# EAGLE design LEDboard_v0.2-R001 (EAGLE 6.5.0)
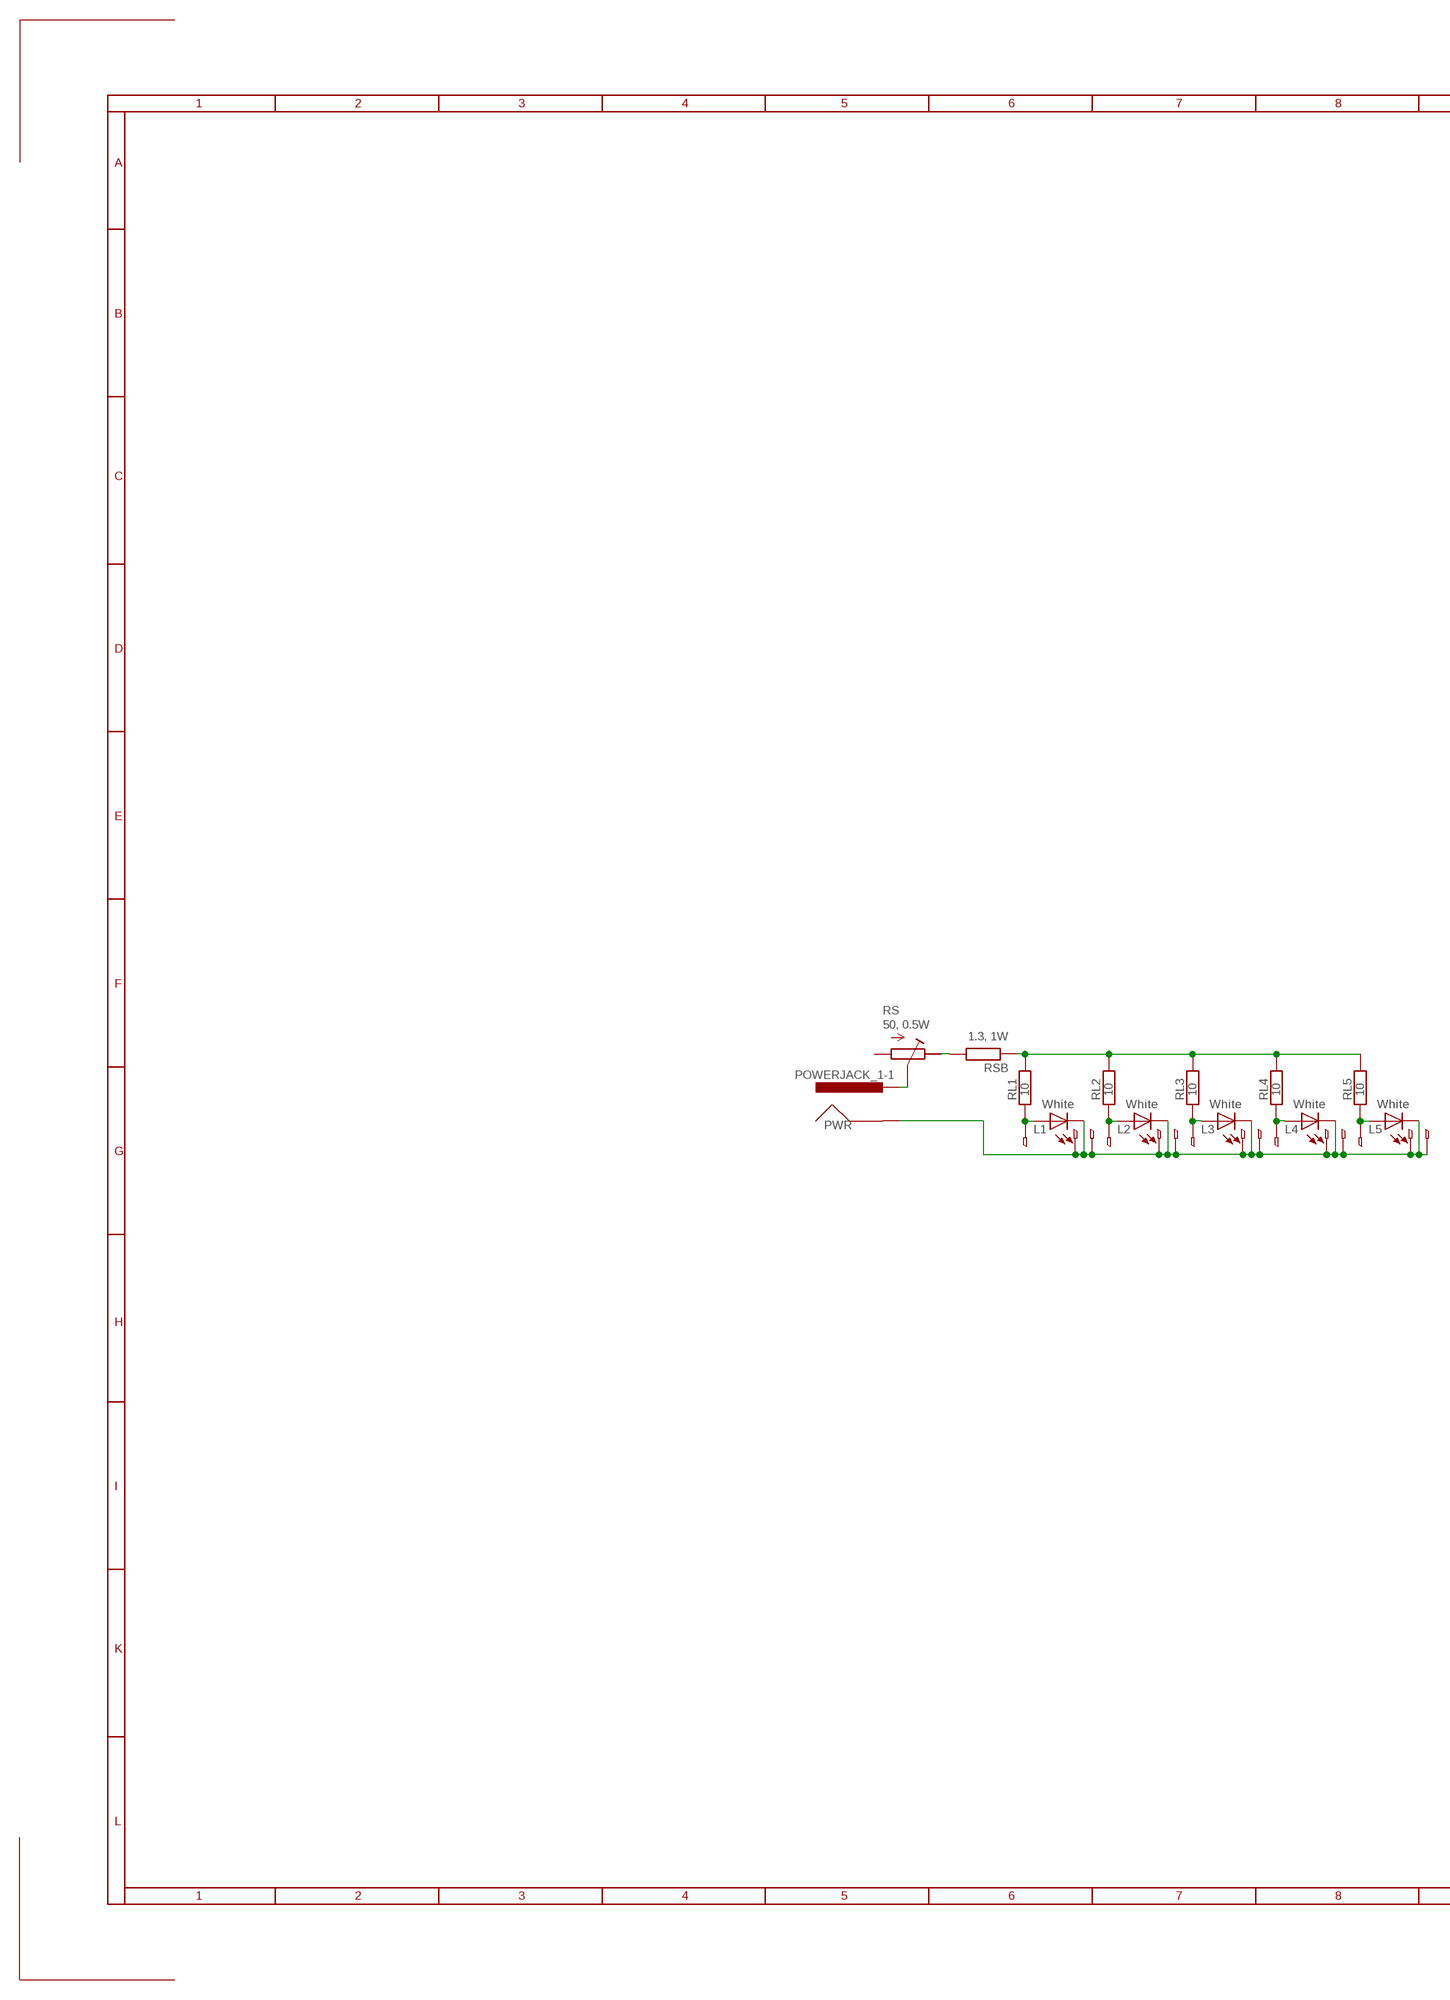
[diagram p0: schematic, sheet 1, part 1 of 2]
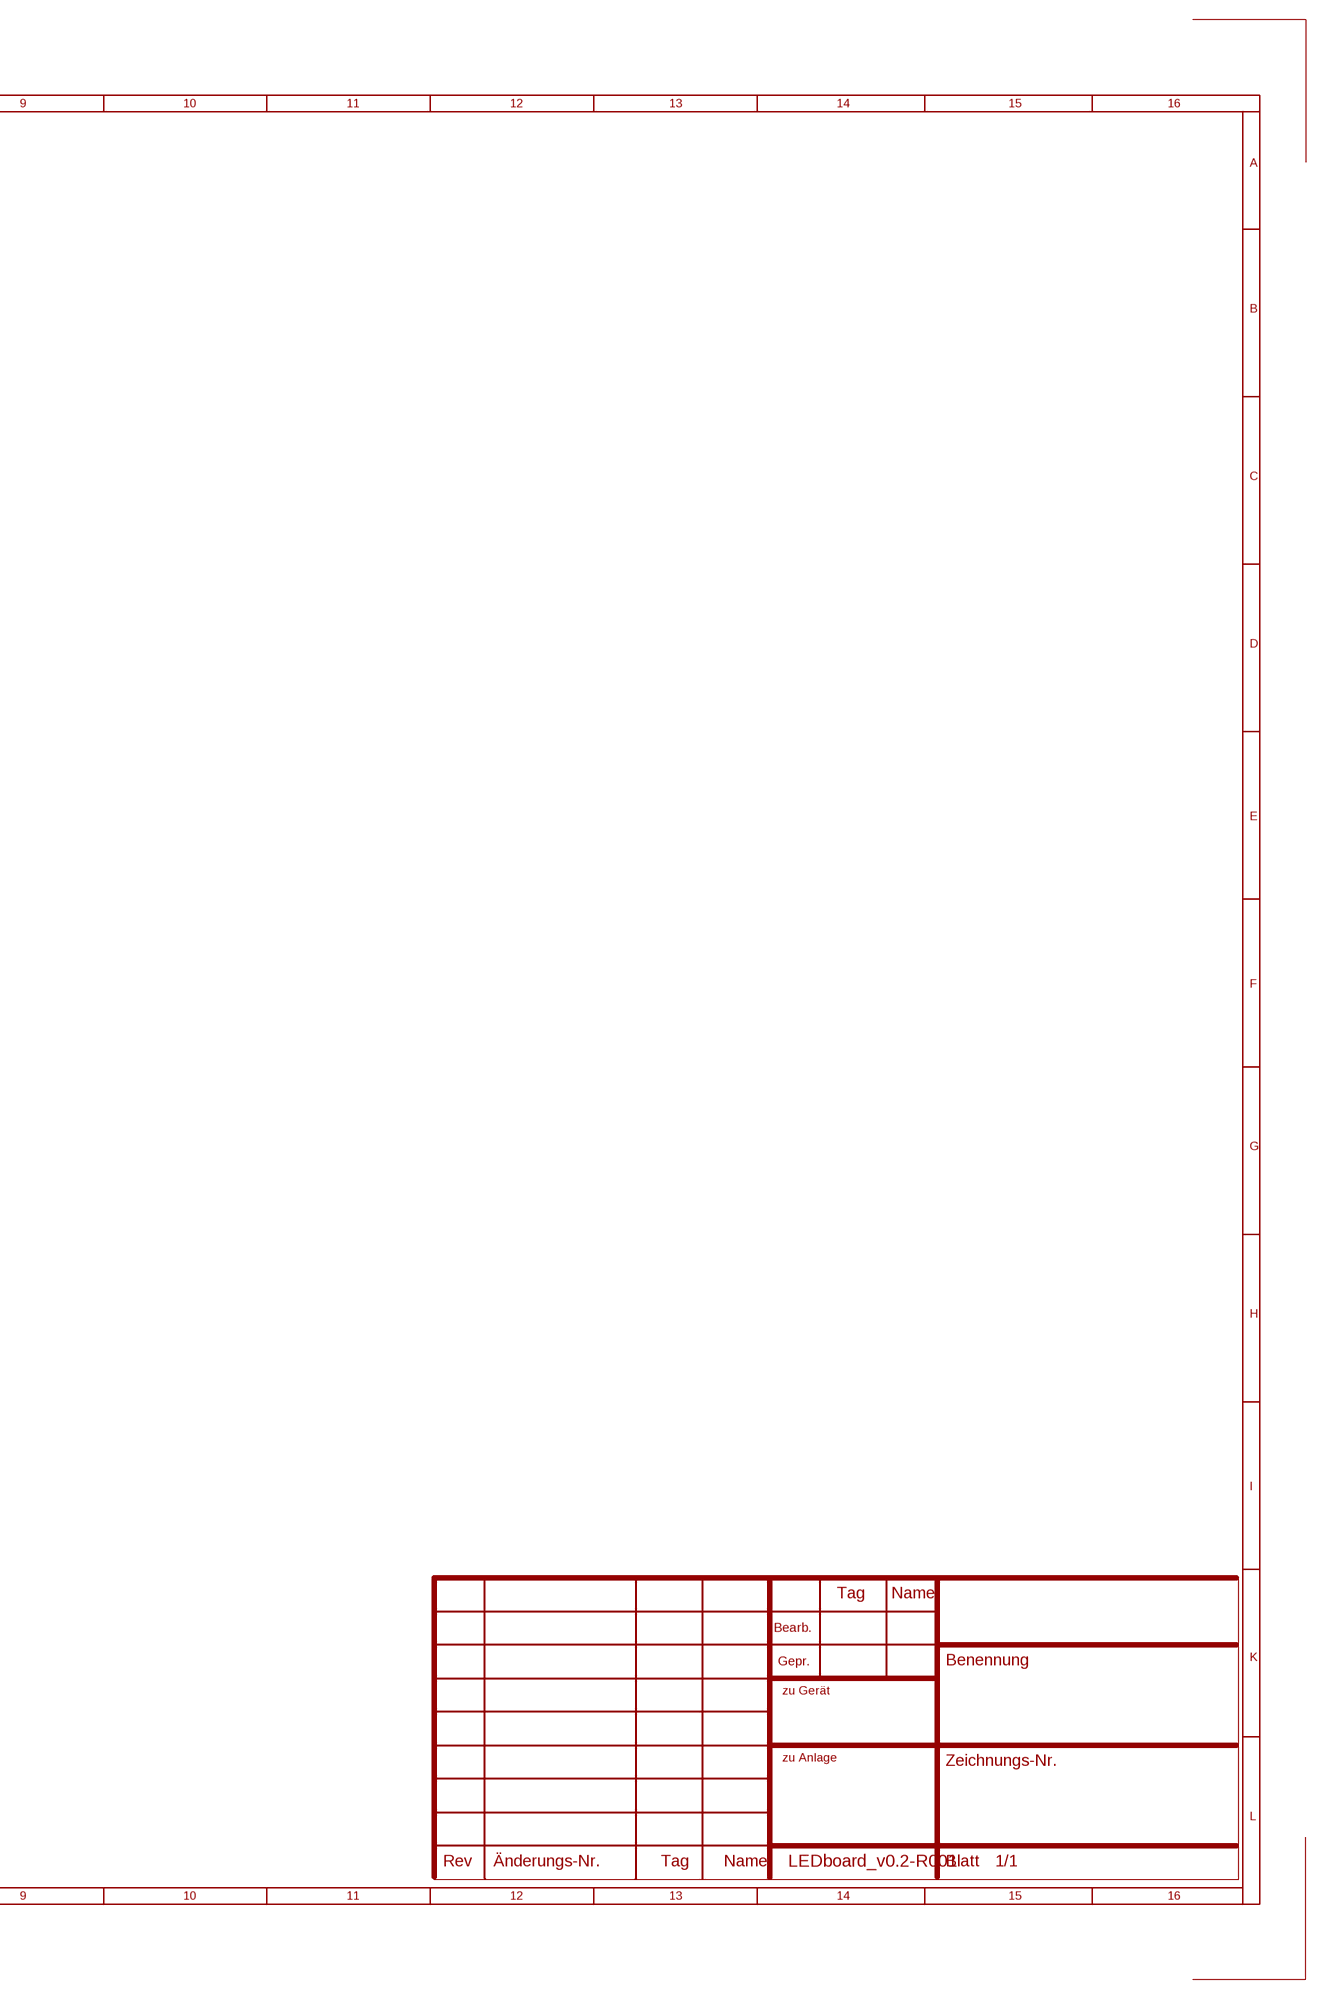
[diagram p1: schematic, sheet 1, part 2 of 2]

## Parts
L1  White  LED_LM561B  [LED_LM561B]
L2  White  LED_LM561B  [LED_LM561B]
L3  White  LED_LM561B  [LED_LM561B]
L4  White  LED_LM561B  [LED_LM561B]
L5  White  LED_LM561B  [LED_LM561B]
PWR  POWERJACK_1-1  [MOLEX_KK4455-2P]
RL1  10  R-EU_R0805  [R0805]
RL2  10  R-EU_R0805  [R0805]
RL3  10  R-EU_R0805  [R0805]
RL4  10  R-EU_R0805  [R0805]
RL5  10  R-EU_R0805  [R0805]
RS  50, 0.5W  R-TRIMM3290H  [RTRIM3290H]
RSB  1.3, 1W  R-EU_0207/2V  [0207/2V]

## Nets
0V: L1.C1(C) L1.C2 L1.C3 L2.C1(C) L2.C2 L2.C3 L3.C1(C) L3.C2 L3.C3 L4.C1(C) L4.C2 L4.C3 L5.C1(C) L5.C2 L5.C3 PWR.1(GND)
N$1: RS.3(A) RSB.2
N$2: RL1.2 RL2.2 RL3.2 RL4.2 RL5.2 RSB.1
N$3: L1.A1(A) L1.A2 RL1.1
N$4: L2.A1(A) L2.A2 RL2.1
N$5: L5.A1(A) L5.A2 RL5.1
N$6: L4.A1(A) L4.A2 RL4.1
N$7: L3.A1(A) L3.A2 RL3.1
N$8: PWR.2(PWR) RS.2(S)
Unconnected: RS.1(E)

## Library data of the parts
L1-L5 = ICST:LED_LM561B
PWR = ICST:POWERJACK_1-1
RL1-RL5 RSB = SABRe:R-EU_: RESISTOR, European symbol
RS = SABRe:R-TRIMM: Trimm resistor

## Board
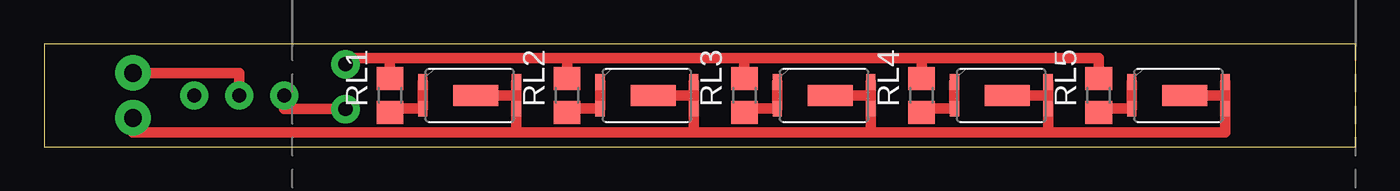
[diagram p2: board, top side]
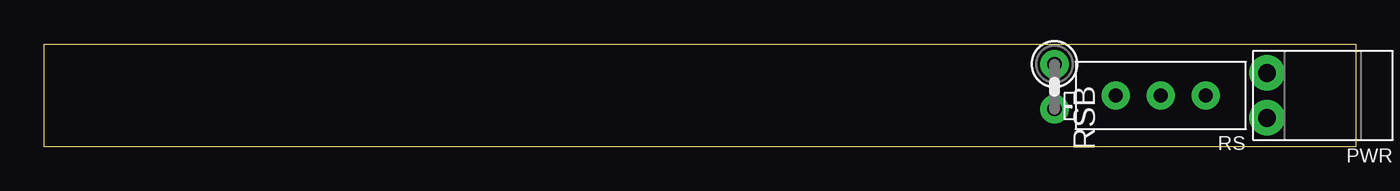
[diagram p3: board, bottom side, seen from below]

Size 74 x 5.8 mm. Coordinates in mm from the lower left corner, seen from the top.
Outline: 0,0 74,0 74,5.8 0,5.8 0,0
Copper layers (1*16): Top 0.035mm / dielectric 1.5mm / Bottom 0.035mm
Design rules "ICST_etching *": minimum track width 0.3mm, minimum drill 0.6mm, track to track 0.15mm, track to pad 0.15mm, pad to pad 0.15mm, via to via 0.15mm, smd to smd 0.15mm, copper to edge 0.3mm, drill to drill 0.3mm, minimum pad ring 0.1mm, minimum via ring 0.1mm, stop-mask expansion 4mil, vias tented up to drill 25mil, thermal gap 10mil

### Footprints (pad centres in the part's own frame; a part is rotated, then mirrored left to right if it is on the bottom)
LED_LM561B = smd 0.52 x 0.9: A1 -2.64,0.75; A2 -2.64,-0.75; C1 2.64,0.75; C2 2.64,-0.75 | smd 2.54 x 1.18: C3 0.35,0
MOLEX_KK4455-2P = drill 1: 1 -1.27,0; 2 1.27,0
R0805 = smd 1.3 x 1.5: 1 -0.95,0; 2 0.95,0
RTRIM3290H = drill 0.8: 1 0,-2.54; 2 0,0; 3 0,2.54
0207/2V = drill 0.8: 1 -1.27,0; 2 1.27,0

### Placement (x,y rotation side)
L1  24,2.9 0 top
L2  34,2.9 0 top
L3  44,2.9 0 top
L4  54,2.9 0 top
L5  64,2.9 0 top
PWR  5,2.9 90 bottom
RL1  19.5,2.9 90 top
RL2  29.5,2.9 90 top
RL3  39.5,2.9 90 top
RL4  49.5,2.9 90 top
RL5  59.5,2.9 90 top
RS  11,2.9 90 bottom
RSB  17,3.4 270 bottom

### Tracks (layer width: path | path; a pad name or v marks a point on that pad's centre or on a via)
0V
  Top 0.6: 66.64,2.9 L5.C2 66.64,0.8 56.64,0.8 | 66.64,2.9 L5.C1 | L4.C1 56.64,2.9 | L3.C1 46.64,2.9 | L3.C3 46.64,2.9 | L4.C3 56.64,2.9 | L2.C1 36.64,2.9 | L2.C3 36.64,2.9 | 36.64,0.8 46.64,0.8 | 46.64,0.8 56.64,0.8 | 56.64,0.8 L4.C2 56.64,2.9 | 46.64,0.8 L3.C2 46.64,2.9 | 36.64,0.8 L2.C2 36.64,2.9 | 66.64,2.9 L5.C3 | 26.64,0.8 36.64,0.8 | 26.64,0.8 L1.C2 26.64,2.9 | L1.C1 26.64,2.9 | L1.C3 26.64,2.9 | 26.64,0.8 5,0.8 PWR.1
N$1
  Top 0.6: RSB.2 13.54,2.13 RS.3
N$2
  Top 0.6: 19.5,5 29.5,5 | 29.5,5 39.5,5 | 39.5,5 49.5,5 | 49.5,5 59.5,5 RL5.2 | RL4.2 49.5,5 | RL1.2 19.5,5 | RL2.2 29.5,5 | RL3.2 39.5,5 | 19.5,5 17,5 RSB.1
N$3
  Top 0.6: L1.A1 L1.A2 19.5,2.15 RL1.1
N$4
  Top 0.6: L2.A1 L2.A2 29.5,2.15 RL2.1
N$5
  Top 0.6: L5.A1 L5.A2 59.5,2.15 RL5.1
N$6
  Top 0.6: L4.A1 L4.A2 49.5,2.15 RL4.1
N$7
  Top 0.6: L3.A1 L3.A2 39.5,2.15 RL3.1
N$8
  Top 0.6: PWR.2 11,4.17 RS.2

### Text on the board
tDocu: Plexiglas dimension